# Altium schematic sheet Telemetry_temp_meas.SchDoc: Telemetry temp meas
size A4; Author: Magnus S. Aarnes; DrawnBy: Magnus Aarnes; Organization: Altium Limited; DocumentNumber: 1; Revision: 1; SheetNumber: 2; SheetTotal: 3
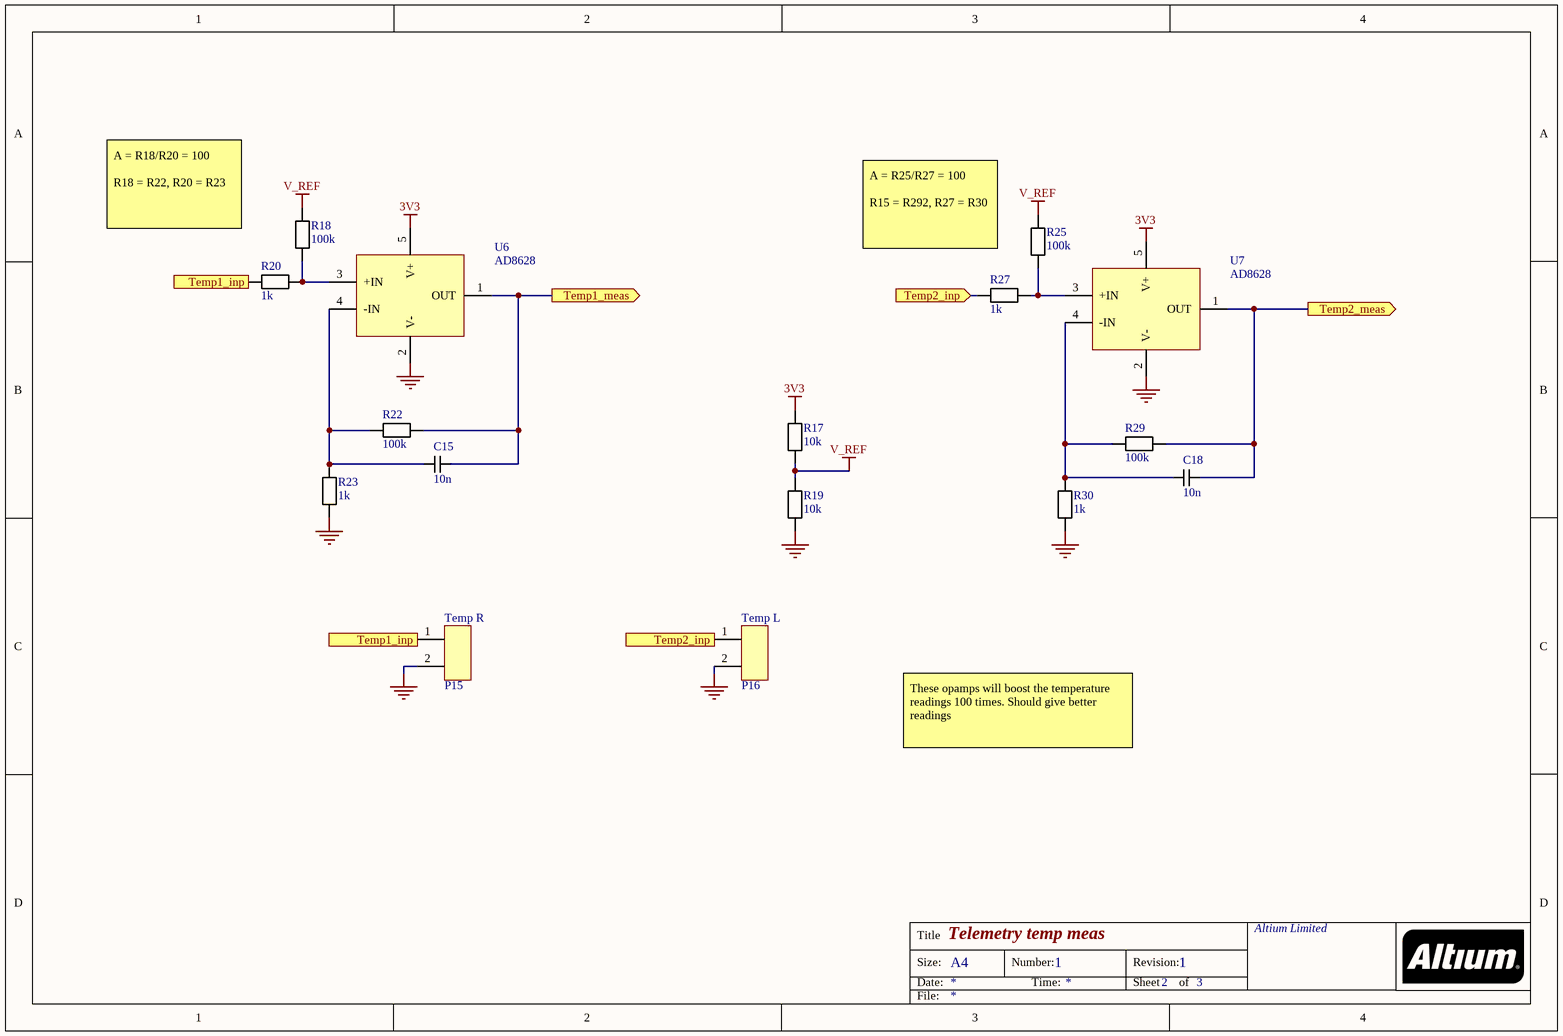
[diagram p0: Telemetry_temp_meas.SchDoc]

## Parts
C15  value 10n  [C_SMD_0805_pcb]  (hidden comment: SMD)
C18  value 10n  [C_SMD_0805_pcb]  (hidden comment: SMD)
P15  Temp R  [JST_SE_2PIN]
P16  Temp L  [JST_SE_2PIN]
R17  value 10k  [R_SMD_0805_pcb]  (hidden comment: SMD)
R18  value 100k  [R_SMD_0805_pcb]  (hidden comment: SMD)
R19  value 10k  [R_SMD_0805_pcb]  (hidden comment: SMD)
R20  value 1k  [R_SMD_0805_pcb]  (hidden comment: SMD)
R22  value 100k  [R_SMD_0805_pcb]  (hidden comment: SMD)
R23  value 1k  [R_SMD_0805_pcb]  (hidden comment: SMD)
R25  value 100k  [R_SMD_0805_pcb]  (hidden comment: SMD)
R27  value 1k  [R_SMD_0805_pcb]  (hidden comment: SMD)
R29  value 100k  [R_SMD_0805_pcb]  (hidden comment: SMD)
R30  value 1k  [R_SMD_0805_pcb]  (hidden comment: SMD)
U6  AD8628  [SOT-23-5]
U7  AD8628  [SOT-23-5]

## Ports
Temp1_inp (in), Temp1_inp (out), Temp1_meas (out), Temp2_inp (in), Temp2_inp (out), Temp2_meas (out)

## Nets
3V3: R17.2 U6.5(V+) U7.5(V+)
GND: P15.2 P16.2 R19.1 R23.1 R30.2 U6.2(V-) U7.2(V-)
V_REF: R17.1 R18.2 R19.2 R25.2
Temp1_inp: P15.1 R20.1 ; port Temp1_inp
Temp1_meas: C15.1 R22.2 U6.1(OUT) ; port Temp1_meas
Temp2_inp: P16.1 R27.1 ; port Temp2_inp
Temp2_meas: C18.1 R29.2 U7.1(OUT) ; port Temp2_meas
NetC15_2: C15.2 R22.1 R23.2 U6.4(-IN)
NetC18_2: C18.2 R29.1 R30.1 U7.4(-IN)
NetR18_1: R18.1 R20.2 U6.3(+IN)
NetR25_1: R25.1 R27.2 U7.3(+IN)

## Notes on the sheet
- A = R18/R20 = 100
  R18 = R22, R20 = R23
- A = R25/R27 = 100
  R15 = R292, R27 = R30
- These opamps will boost the temperature readings 100 times. Should give better readings
- Title
- Size:
- Date:
- A4
- Number:
- Time:
- Revision:
- Sheet
- of
- File:

## Library data of the parts
C15 C18 = C_SMD_0805: Supplier 1: *; Supplier Part Number 1: *
P15 P16 = JST_SE_2PIN: Supplier 1: *; Supplier Part Number 1: *
R17-R20 R22 R23 R25 R27 R29 R30 = R_SMD_0805: Supplier 1: *; Supplier Part Number 1: *
U6 U7 = AD8628WAUJZ-R7_SOT-23-5: Supplier Part Number 1: AD8628WAUJZ-R7CT-ND; Supplier Link 1: https://www.digikey.com/product-detail/en/analog-devices-inc/AD8628WAUJZ-R7/AD8628WAUJZ-R7CT-ND/2467896